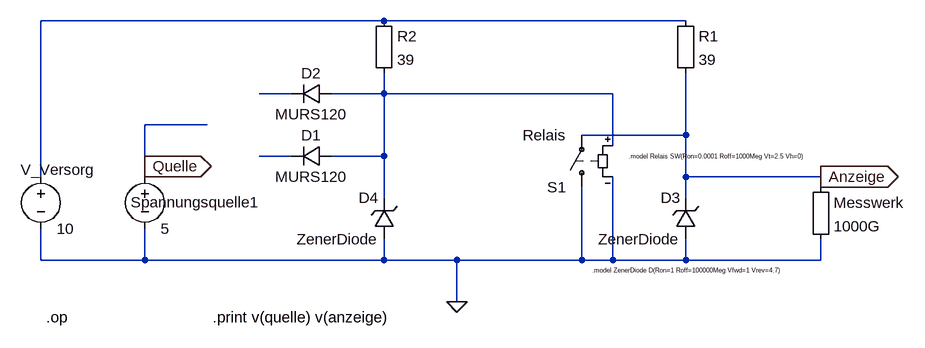
[diagram p0: schematic V2 NAND1.asc]
V2 NAND1.asc, the LTspice schematic file:
Version 4
SHEET 1 920 680
WIRE -272 -64 -800 -64
WIRE 192 -64 -272 -64
WIRE -416 48 -464 48
WIRE -272 48 -272 16
WIRE -272 48 -352 48
WIRE 80 48 -272 48
WIRE -544 96 -640 96
WIRE 192 112 192 16
WIRE 192 112 32 112
WIRE 80 128 80 48
WIRE -416 144 -464 144
WIRE -272 144 -272 48
WIRE -272 144 -352 144
WIRE -640 160 -640 96
WIRE -800 176 -800 -64
WIRE -640 176 -640 160
WIRE 192 176 192 112
WIRE 400 176 192 176
WIRE 400 192 400 176
WIRE -272 208 -272 144
WIRE 192 208 192 176
WIRE -800 304 -800 256
WIRE -640 304 -640 256
WIRE -640 304 -800 304
WIRE -272 304 -272 272
WIRE -272 304 -640 304
WIRE -160 304 -272 304
WIRE 32 304 32 192
WIRE 32 304 -160 304
WIRE 80 304 80 176
WIRE 80 304 32 304
WIRE 192 304 192 272
WIRE 192 304 80 304
WIRE 400 304 400 272
WIRE 400 304 192 304
WIRE -160 368 -160 304
FLAG -160 368 0
FLAG 400 176 Anzeige
IOPIN 400 176 Out
FLAG -640 160 Quelle
IOPIN -640 160 Out
SYMBOL Misc\\EuropeanResistor 384 176 R0
SYMATTR InstName Messwerk
SYMATTR Value 1000G
SYMBOL Misc\\EuropeanResistor 176 -80 R0
SYMATTR InstName R1
SYMATTR Value 39
SYMBOL zener 208 272 R180
WINDOW 0 24 64 Left 2
WINDOW 3 24 0 Left 2
SYMATTR InstName D3
SYMATTR Value ZenerDiode
SYMATTR Description Diode
SYMATTR Type diode
SYMBOL voltage -800 160 R0
WINDOW 0 -31 5 Left 2
SYMATTR InstName V_Versorg
SYMATTR Value 10
SYMBOL sw 32 208 R180
SYMATTR InstName S1
SYMATTR Value Relais
SYMBOL Misc\\EuropeanResistor -288 -80 R0
SYMATTR InstName R2
SYMATTR Value 39
SYMBOL diode -352 128 R90
WINDOW 0 0 32 VBottom 2
WINDOW 3 32 32 VTop 2
SYMATTR InstName D1
SYMATTR Value MURS120
SYMBOL diode -352 32 R90
WINDOW 0 0 32 VBottom 2
WINDOW 3 32 32 VTop 2
SYMATTR InstName D2
SYMATTR Value MURS120
SYMBOL zener -256 272 R180
WINDOW 0 24 64 Left 2
WINDOW 3 24 0 Left 2
SYMATTR InstName D4
SYMATTR Value ZenerDiode
SYMATTR Description Diode
SYMATTR Type diode
SYMBOL voltage -640 160 R0
WINDOW 0 -22 55 Left 2
WINDOW 123 0 0 Left 0
WINDOW 39 0 0 Left 0
SYMATTR InstName Spannungsquelle1
SYMATTR Value 5
TEXT -792 392 Left 2 !.op
TEXT -536 392 Left 2 !.print v(quelle) v(anzeige)
TEXT 48 320 Left 0 !.model ZenerDiode D(Ron=1 Roff=100000Meg Vfwd=1 Vrev=4.7)
TEXT 104 144 Left 0 !.model Relais SW(Ron=0.0001 Roff=1000Meg Vt=2.5 Vh=0)

The netlist it stands for:
* V2 NAND1.asc
R§Messwerk Anzeige 0 1000G
R1 N001 Anzeige 39
D3 0 Anzeige ZenerDiode
V_Versorg N001 0 10
S1 0 Anzeige N003 0 Relais
R2 N001 N003 39
D1 N003 N004 MURS120
D2 N003 N002 MURS120
D4 0 N003 ZenerDiode
V§Spannungsquelle1 Quelle 0 5
.model D D
.lib standard.dio
.op
.print v(quelle) v(anzeige)
.model ZenerDiode D(Ron=1 Roff=100000Meg Vfwd=1 Vrev=4.7)
.model Relais SW(Ron=0.0001 Roff=1000Meg Vt=2.5 Vh=0)
.backanno
.end